# Altium schematic sheet ArduinoUnoCopy_Schematic.SchDoc
size C; SheetNumber: 1; SheetTotal: 1
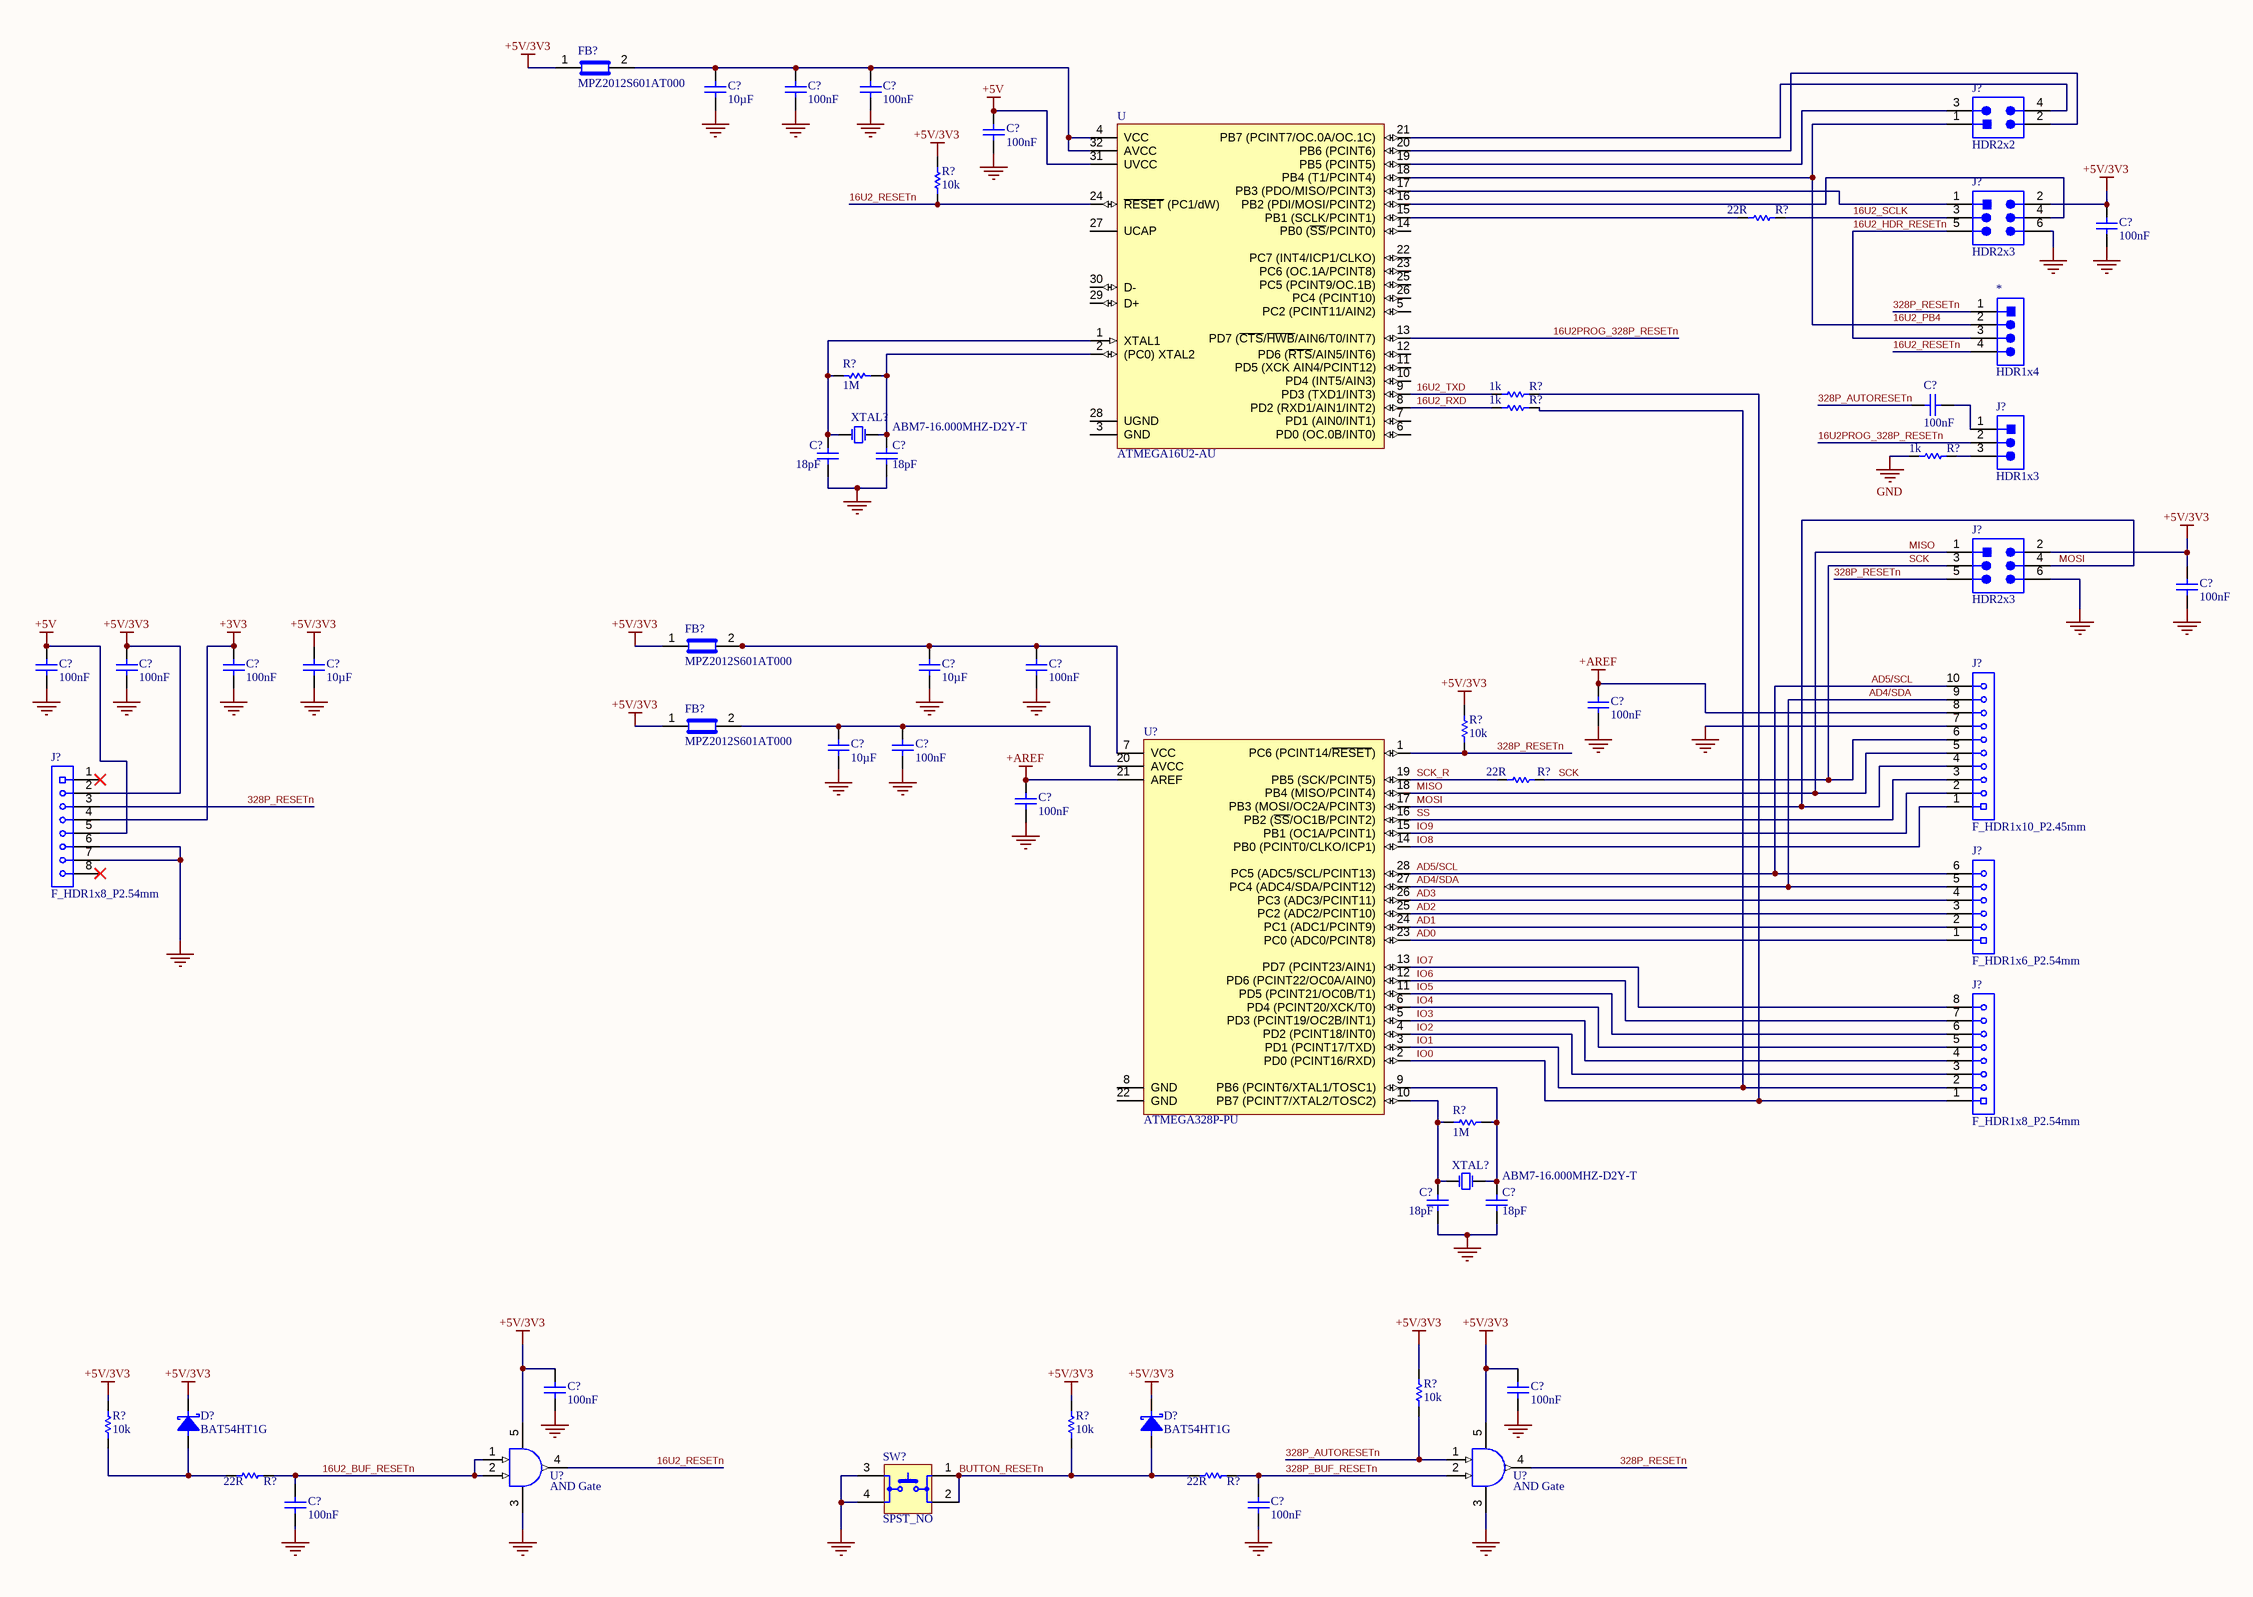
[diagram p0: ArduinoUnoCopy_Schematic.SchDoc]

## Parts
(Parts that share a designator on the sheet are numbered #1, #2 ... from top to bottom, then left to right.)
*  HDR1x4  [M_HDR1x4_P2.54mm]
C?#1  10µF  [C0805]
C?#2  100nF  [C0805]
C?#3  100nF  [C0805]
C?#4  100nF  [C0805]
C?#5  100nF  [C0805]
C?#6  100nF  [C0805]
C?#7  18pF  [C0805]
C?#8  18pF  [C0805]
C?#9  100nF  [C0805]
C?#10  100nF  [C0805]
C?#11  100nF  [C0805]
C?#12  100nF  [C0805]
C?#13  10µF  [C0805]
C?#14  10µF  [C0805]
C?#15  100nF  [C0805]
C?#16  100nF  [C0805]
C?#17  10µF  [C0805]
C?#18  100nF  [C0805]
C?#19  100nF  [C0805]
C?#20  18pF  [C0805]
C?#21  18pF  [C0805]
C?#22  100nF  [C0805]
C?#23  100nF  [C0805]
C?#24  100nF  [C0805]
C?#25  100nF  [C0805]
D?#1  BAT54HT1G  [SOD323]
D?#2  BAT54HT1G  [SOD323]
FB?#1  MPZ2012S601AT000  [FB0805]
FB?#2  MPZ2012S601AT000  [FB0805]
FB?#3  MPZ2012S601AT000  [FB0805]
J?#1  HDR2x2  [M_HDR2x2_P2.54mm]
J?#2  HDR2x3  [M_HDR2x3_P2.54mm]
J?#3  HDR1x3  [M_HDR1x3_P2.54mm]
J?#4  HDR2x3  [M_HDR2x3_P2.54mm]
J?#5  F_HDR1x8_P2.54mm  [F_HDR1x8_P2.54mm]
J?#6  F_HDR1x10_P2.45mm  [F_HDR1x10_P2.54mm]
J?#7  F_HDR1x6_P2.54mm  [F_HDR1x6_P2.54mm]
J?#8  F_HDR1x8_P2.54mm  [F_HDR1x8_P2.54mm]
R?#1  10k  [R0805]
R?#2  22R  [R0805]
R?#3  1M  [R0805]
R?#4  1k  [R0805]
R?#5  1k  [R0805]
R?#6  1k  [R0805]
R?#7  10k  [R0805]
R?#8  22R  [R0805]
R?#9  1M  [R0805]
R?#10  10k  [R0805]
R?#11  10k  [R0805]
R?#12  10k  [R0805]
R?#13  22R  [R0805]
R?#14  22R  [R0805]
SW?  SPST_NO  [SPST-NO_P4.5mmx7.8mm_H5mm]
U  ATMEGA16U2-AU  [TQFP32P080W7X7]
U?#1  ATMEGA328P-PU  [DIP28P254LS726mm]
U?#2  AND Gate  [SOT23_P0.95mm]
U?#3  AND Gate  [SOT23_P0.95mm]
XTAL?#1  ABM7-16.000MHZ-D2Y-T
XTAL?#2  ABM7-16.000MHZ-D2Y-T

## Nets
+3V3: C?#12.2 J?#5.4
+5V: C?#4.2 C?#10.2 J?#5.5 U.31(UVCC)
+5V/3V3: C?#5.2 C?#9.2 C?#11.2 C?#13.2 C?#22.2 C?#23.2 D?#1.C(Cathode) D?#2.C(Cathode) FB?#1.1 FB?#2.1 FB?#3.1 J?#2.2 J?#4.2 J?#5.2 R?#1.2 R?#7.2 R?#10.2 R?#11.2 R?#12.2 U?#2.5(VCC) U?#3.5(VCC)
+AREF: C?#16.2 C?#19.2 J?#6.8 U?#1.21(AREF)
GND: C?#1.1 C?#2.1 C?#3.1 C?#4.1 C?#5.1 C?#7.1 C?#8.1 C?#9.1 C?#10.1 C?#11.1 C?#12.1 C?#13.1 C?#14.1 C?#15.1 C?#16.1 C?#17.1 C?#18.1 C?#19.1 C?#20.1 C?#21.1 C?#22.1 C?#23.1 C?#24.1 C?#25.1 J?#2.6 J?#4.6 J?#5.6 J?#5.7 J?#6.7 R?#6.1 SW?.3 SW?.4 U?#2.3(GND) U?#3.3(GND)
16U2_BUF_RESETn: C?#24.2 R?#13.2 U?#2.1(A) U?#2.2(B)
16U2_HDR_RESETn: *.3 J?#2.5
16U2_PB4: *.2 J?#1.1 U.18(PB4_(T1/PCINT4))
16U2_RESETn: *.4 R?#1.1 U.24(~{RESET}_(PC1/dW)) U?#2.4(Y)
16U2_RXD: R?#5.1 U.8(PD2_(RXD1/AIN1/INT2))
16U2_SCLK: J?#2.3 R?#2.2
16U2_TXD: R?#4.1 U.9(PD3_(TXD1/INT3))
16U2PROG_328P_RESETn: J?#3.2 U.13(PD7_(~{CTS}/~{HWB}/AIN6/T0/INT7))
328P_AUTORESETn: C?#6.1 R?#10.1 U?#3.1(A)
328P_BUF_RESETn: C?#25.2 R?#14.2 U?#3.2(B)
328P_RESETn: *.1 J?#4.5 J?#5.3 R?#7.1 U?#1.1(PC6_(PCINT14/~{RESET})) U?#3.4(Y)
AD0: J?#7.1 U?#1.23(PC0_(ADC0/PCINT8))
AD1: J?#7.2 U?#1.24(PC1_(ADC1/PCINT9))
AD2: J?#7.3 U?#1.25(PC2_(ADC2/PCINT10))
AD3: J?#7.4 U?#1.26(PC3_(ADC3/PCINT11))
AD4/SDA: J?#6.9 J?#7.5 U?#1.27(PC4_(ADC4/SDA/PCINT12))
AD5/SCL: J?#6.10 J?#7.6 U?#1.28(PC5_(ADC5/SCL/PCINT13))
BUTTON_RESETn: D?#2.A(Anode) R?#12.1 R?#14.1 SW?.1 SW?.2
IO0: J?#8.1 R?#4.2 U?#1.2(PD0_(PCINT16/RXD))
IO1: J?#8.2 R?#5.2 U?#1.3(PD1_(PCINT17/TXD))
IO2: J?#8.3 U?#1.4(PD2_(PCINT18/INT0))
IO3: J?#8.4 U?#1.5(PD3_(PCINT19/OC2B/INT1))
IO4: J?#8.5 U?#1.6(PD4_(PCINT20/XCK/T0))
IO5: J?#8.6 U?#1.11(PD5_(PCINT21/OC0B/T1))
IO6: J?#8.7 U?#1.12(PD6_(PCINT22/OC0A/AIN0))
IO7: J?#8.8 U?#1.13(PD7_(PCINT23/AIN1))
IO8: J?#6.1 U?#1.14(PB0_(PCINT0/CLKO/ICP1))
IO9: J?#6.2 U?#1.15(PB1_(OC1A/PCINT1))
MISO: J?#4.1 J?#6.5 U?#1.18(PB4_(MISO/PCINT4))
MOSI: J?#4.4 J?#6.4 U?#1.17(PB3_(MOSI/OC2A/PCINT3))
SCK: J?#4.3 J?#6.6 R?#8.2
SCK_R: R?#8.1 U?#1.19(PB5_(SCK/PCINT5))
SS: J?#6.3 U?#1.16(PB2_(~{SS}/OC1B/PCINT2))
NetC?#1_2: C?#1.2 C?#2.2 C?#3.2 FB?#1.2 U.4(VCC) U.32(AVCC)
NetC?#6_2: C?#6.2 J?#3.1
NetC?#7_2: C?#7.2 R?#3.2 U.1(XTAL1) XTAL?#1.2(X2)
NetC?#8_2: C?#8.2 R?#3.1 U.2((PC0)_XTAL2) XTAL?#1.1(X1)
NetC?#14_2: C?#14.2 C?#15.2 FB?#2.2 U?#1.7(VCC)
NetC?#17_2: C?#17.2 C?#18.2 FB?#3.2 U?#1.20(AVCC)
NetC?#20_2: C?#20.2 R?#9.1 U?#1.10(PB7_(PCINT7/XTAL2/TOSC2)) XTAL?#2.1(X1)
NetC?#21_2: C?#21.2 R?#9.2 U?#1.9(PB6_(PCINT6/XTAL1/TOSC1)) XTAL?#2.2(X2)
NetD?#1_A: D?#1.A(Anode) R?#11.1 R?#13.1
NetJ?#1_2: J?#1.2 U.20(PB6_(PCINT6))
NetJ?#1_3: J?#1.3 U.19(PB5_(PCINT5))
NetJ?#1_4: J?#1.4 U.21(PB7_(PCINT7/OC.0A/OC.1C))
NetJ?#2_1: J?#2.1 U.17(PB3_(PDO/MISO/PCINT3))
NetJ?#2_4: J?#2.4 U.16(PB2_(PDI/MOSI/PCINT2))
NetJ?#3_3: J?#3.3 R?#6.2
NetR?#2_1: R?#2.1 U.15(PB1_(SCLK/PCINT1))

Not connected (* = marked no-connect by the designer): J?#5 1* 8*; U 3(GND) 5(PC2_(PCINT11/AIN2)) 6(PD0_(OC.0B/INT0)) 7(PD1_(AIN0/INT1)) 10(PD4_(INT5/AIN3)) 11(PD5_(XCK_AIN4/PCINT12)) 12(PD6_(~{RTS}/AIN5/INT6)) 14(PB0_(~{SS}/PCINT0)) 22(PC7_(INT4/ICP1/CLKO)) 23(PC6_(OC.1A/PCINT8)) 25(PC5_(PCINT9/OC.1B)) 26(PC4_(PCINT10)) 27(UCAP) 28(UGND) 29(D+) 30(D-); U?#1 8(GND) 22(GND)

## Notes on the sheet
- THIS DOCUMENT AND THE DATA DISCLOSED HEREIN OR
- HEREWITH IS THE PROPERTY OF ALTIUM LIMITED AND MAY
- DWG NO:
- REVISION
- REV:
- DESCRIPTION
- DATE
- APPROVED
- BE FREELY DISTRIBUTED IN WHOLE. NO RIGHTS ARE
- RESERVED OR EXPRESS OR IMPLIED WARANTEE GIVEN.
- ENG:
- APPROVALS
- PROJECT
- DSN:
- CHK:
- REFERENCE DOCUMENTS
- PROJECT REVISION:
- TITLE
- DOCUMENT REVISION:
- DESIGN ITEM:
- BOM:
- FAB DWG:
- PCB DWG:
- ASSY DWG:
- SCALE:
- A3
- SIZE
- CAGE CODE
- FILE NAME
- DWG NO.
- SHEET
- OF
- REV

## Library data of the parts
* = 68001-204HLF: CONN HEADER VERT 4POS 2.54MM; Manufacturer: Amphenol FCI; Number of Contacts: 4; Insulation Resistance: 5GR; Gender: Male; Current Rating: 3A; Voltage Rating: 1.5kV; Connector Type: Male Pin; Contact Post Length: 3.05mm; Part Name: 68001-204HLF; Supplier 1: Farnell; Supplier Part Number 1: 2892426; Manufacturer Part Number: 68001-204HLF; RoHS: Yes; Category: Headers and Wire Housings; Stock 1: 1286; Pricing 1: 1=0,36400, 10=0,25600, 25=0,25200, 50=0,25000; Mount: Through Hole; Contact Plating: Gold,GXT; Contact Material: Bronze; Color: Black; Housing Material: Thermoplastic; Min Operating Temperature: -65°C; Max Operating Temperature: 125°C; Termination: Solder; Number of Rows: 1; Orientation: Straight; Number of Positions: 4; Packaging: Bulk; Package Quantity: 100; Contact Gender: Male; Pitch: 2.54mm; Contact Mating Length: 0.23inch; Radiation Hardening: No; Flammability Rating: UL94 V-0; ComponentLink1URL: https://datasheet.ciiva.com/5164/68000-274255; ComponentLink1Description: https://datasheet.ciiva.com/5164/68000-274255; ComponentLink2URL: https://datasheet.ciiva.com/726/68000-726529.; ComponentLink2Description: https://datasheet.ciiva.com/726/68000-726529.
C?#1 C?#13 C?#14 C?#17 = C2012X5R1E106K125AB: TDK - C2012X5R1E106K125AB - Keramikvielschich; Dielectric Material: Ceramic; Capacitance: 10uF; Tolerance: 10%; Dielectric: X5R; Voltage Rating: 25V; Part Name: C2012X5R1E106K125AB; Supplier 1: Farnell; Supplier Part Number 1: 2346927; Manufacturer: TDK; Manufacturer Part Number: C2012X5R1E106K125AB; RoHS: Yes; Category: Ceramic Capacitors; Stock 1: 21227; Pricing 1: 5=0,25900, 50=0,14600, 250=0,14100, 500=0,106; Mount: Surface Mount; Case/Package: 0805; Case Code (Metric): 2012; Case Code (Imperial): 0805; Weight: 0.000194oz; Min Operating Temperature: -55°C; Max Operating Temperature: 85°C; Packaging: Tape and Reel; Voltage Rating (DC): 25V; Termination: SMD/SMT; Package Quantity: 1; Resistor Type: Ceramic; Voltage: 25V; Length: 2mm; Width: 0.049inch; Height: 1.25mm; Depth: 1.25mm; Thickness: 0.057inch; REACH SVHC: No SVHC; Lead Free: Lead Free; ComponentLink1URL: https://datasheet.ciiva.com/22725/1913358-227; ComponentLink1Description: https://datasheet.ciiva.com/22725/1913358-227; ComponentLink2URL: https://datasheet.ciiva.com/16394/general-b11; ComponentLink2Description: https://datasheet.ciiva.com/16394/general-b11; ComponentLink3URL: https://datasheet.ciiva.com/24216/mlcc-commer; ComponentLink3Description: https://datasheet.ciiva.com/24216/mlcc-commer
C?#2-C?#6 C?#9-C?#12 C?#15 C?#16 C?#18 C?#19 C?#22-C?#25 = C2012X7R1H104K085AA: TDK - C2012X7R1H104K085AA - SMD Multilayer Ce; Dielectric Material: Ceramic; Tolerance: 10%; Dielectric: X7R; Voltage Rating: 50V; Part Name: C2012X7R1H104K085AA; Supplier 1: Farnell; Supplier Part Number 1: 2525147; Manufacturer: TDK; Manufacturer Part Number: C2012X7R1H104K085AA; RoHS: Yes; Category: Ceramic Capacitors; Stock 1: 12319; Pricing 1: 10=0,06990, 100=0,05700, 500=0,03580, 1000=0,; Mount: Surface Mount; Case/Package: 0805; Number of Pins: 2; Case Code (Metric): 2012; Case Code (Imperial): 0805; Weight: 0.000194oz; Min Operating Temperature: -55°C; Max Operating Temperature: 125°C; Capacitance: 100nF; Packaging: Tape and Reel; Voltage Rating (DC): 50V; Termination: SMD/SMT; Package Quantity: 1; Resistor Type: Ceramic; Voltage: 50V; Length: 2mm; Width: 0.049inch; Height: 0.85mm; Depth: 1.25mm; Thickness: 0.037inch; Radiation Hardening: No; REACH SVHC: No SVHC; Lead Free: Lead Free; ComponentLink1URL: https://datasheet.ciiva.com/11788/0900766b80c; ComponentLink1Description: https://datasheet.ciiva.com/11788/0900766b80c; ComponentLink2URL: https://datasheet.ciiva.com/6250/tdkmlcccapra; ComponentLink2Description: https://datasheet.ciiva.com/6250/tdkmlcccapra; ComponentLink3URL: https://datasheet.ciiva.com/24191/e412-c-2419; ComponentLink3Description: https://datasheet.ciiva.com/24191/e412-c-2419; ComponentLink4URL: https://datasheet.ciiva.com/6250/tdkmlcccapra; ComponentLink4Description: https://datasheet.ciiva.com/6250/tdkmlcccapra; ComponentLink5URL: https://datasheet.ciiva.com/23803/1796654-238; ComponentLink5Description: https://datasheet.ciiva.com/23803/1796654-238; ComponentLink6URL: https://datasheet.ciiva.com/28602/1571323-286; ComponentLink6Description: https://datasheet.ciiva.com/28602/1571323-286
C?#7 C?#8 C?#20 C?#21 = C0805C180J5GACTU: CAP CER 18PF 50V C0G/NP0 0805; Manufacturer: KEMET; Dielectric Material: Ceramic; Tolerance: 5%; Dielectric: C0G; Temperature Coefficient: 30ppm/°C; Part Name: C0805C180J5GACTU; Supplier 1: Farnell; Supplier Part Number 1: 1414673; Manufacturer Part Number: C0805C180J5GACTU; RoHS: Yes; Category: Ceramic Capacitors; Stock 1: 37559; Pricing 1: 10=0,04930, 100=0,03400, 500=0,02640, 1000=0,; Mount: Surface Mount; Case/Package: 0805; Min Operating Temperature: -55°C; Max Operating Temperature: 125°C; Capacitance: 18pF; Packaging: Tape and Reel; Voltage Rating (DC): 50V; Termination: SMD/SMT; Voltage: 50V; Length: 2mm; Height: 0.78mm; Depth: 1.25mm; Radiation Hardening: No; Lead Free: Lead Free; ComponentLink1URL: https://datasheet.ciiva.com/22746/1769375-227; ComponentLink1Description: https://datasheet.ciiva.com/22746/1769375-227; ComponentLink2URL: https://datasheet.ciiva.com/26923/getdatashee; ComponentLink2Description: https://datasheet.ciiva.com/26923/getdatashee; ComponentLink3URL: https://datasheet.ciiva.com/26847/getdatashee; ComponentLink3Description: https://datasheet.ciiva.com/26847/getdatashee; Contact Plating: Tin,Matte
D?#1 D?#2 = BAT54HT1G: Small Signal Schottky Diode, Single, 30 V, 200 mA, 800 mV, 600 mA, 150 C ;RoHS Compliant: Yes; Manufacturer: ON Semiconductor / Fairchild; Forward Voltage: 800mV; Forward Current: 200mA; Recovery Time: 5ns; Max Repetitive Reverse Voltage (Vrrm): 30V; Peak Non-Repetitive Surge Current: 600mA; Max Reverse Current: 2uA; Power Dissipation: 200mW; Polarity: Standard; Capacitance: 10pF; Part Name: BAT54HT1G; Supplier 1: Farnell; Supplier Part Number 1: 1459033; Manufacturer Part Number: BAT54HT1G; RoHS: Yes; Category: Schottky Diodes; Stock 1: 20128; Pricing 1: 5=0,18300, 10=0,15600, 100=0,05220, 500=0,05120 (GBP); Mount: Surface Mount; Number of Pins: 2; Contact Plating: Tin,Matte; Min Operating Temperature: -55°C; Max Operating Temperature: 150°C; Packaging: Tape and Reel; Package Quantity: 3000; Average Rectified Current: 200mA; Reverse Recovery Time: 5ns; Max Forward Surge Current (Ifsm): 600mA; Element Configuration: Single; Max Reverse Voltage (DC): 30V; Max Surge Current: 600mA; Voltage Rating (DC): 30V; Current Rating: 200mA; Output Current: 200mA; Reverse Voltage: 30V; Max Reverse Leakage Current: 2uA; Length: 1.8mm; Width: 1.35mm; Height: 1mm; Radiation Hardening: No; Lead Free: Lead Free; RoHS Compliant: Yes; REACH SVHC: No SVHC; ComponentLink1URL: https://datasheet.ciiva.com/4714/bat54ht1-d-72881-4714706.pdf?src-supplier=Mouser; ComponentLink1Description: https://datasheet.ciiva.com/4714/bat54ht1-d-72881-4714706.pdf?src-supplier=Mouser; ComponentLink2URL: https://datasheet.ciiva.com/30479/0900766b811a63a9-30479442.pdf?src-supplier=RSComponents; ComponentLink2Description: https://datasheet.ciiva.com/30479/0900766b811a63a9-30479442.pdf?src-supplier=RSComponents; ComponentLink3URL: https://datasheet.ciiva.com/34301/806549-34301562.pdf?src-supplier=Jameco; ComponentLink3Description: https://datasheet.ciiva.com/34301/806549-34301562.pdf?src-supplier=Jameco; ComponentLink4URL: https://datasheet.ciiva.com/1240/1747983-1240762.pdf?src-supplier=Newark; ComponentLink4Description: https://datasheet.ciiva.com/1240/1747983-1240762.pdf?src-supplier=Newark; ComponentLink5URL: https://datasheet.ciiva.com/4452/bat54ht1g-104602-4452889.pdf?src-supplier=Mouser; ComponentLink5Description: https://datasheet.ciiva.com/4452/bat54ht1g-104602-4452889.pdf?src-supplier=Mouser; ComponentLink6URL: https://datasheet.ciiva.com/910/bat54ht1g-910497.pdf?src-supplier=Digi-Key; ComponentLink6Description: https://datasheet.ciiva.com/910/bat54ht1g-910497.pdf?src-supplier=Digi-Key; ComponentLink7URL: https://datasheet.ciiva.com/1180/bat54ht1-d-1180252.pdf?src-supplier=Element14; ComponentLink7Description: https://datasheet.ciiva.com/1180/bat54ht1-d-1180252.pdf?src-supplier=Element14; ComponentLink8URL: https://datasheet.ciiva.com/1180/bat54ht1-d-1180251.pdf?src-supplier=Element14; ComponentLink8Description: https://datasheet.ciiva.com/1180/bat54ht1-d-1180251.pdf?src-supplier=Element14; ComponentLink9URL: https://datasheet.ciiva.com/46429/1727620-46429206.pdf?src-supplier=Element14; ComponentLink9Description: https://datasheet.ciiva.com/46429/1727620-46429206.pdf?src-supplier=Element14; ComponentLink10URL: https://datasheet.ciiva.com/8294/bat54ht1-d-8294645.pdf?src-supplier=Avnet
FB?#1-FB?#3 = MPZ2012S601AT000: FERRITE BEAD 600 OHM 0805 1LN; Manufacturer: TDK; Impedance: 600R; Current Rating: 2A; DC Resistance (DCR): 100mR; Part Name: MPZ2012S601AT000; Supplier 1: Farnell; Supplier Part Number 1: 2393201; Manufacturer Part Number: MPZ2012S601AT000; RoHS: Yes; Category: Ferrite Beads and Chips; Stock 1: 13705; Pricing 1: 1=0,11600, 25=0,08910, 50=0,06600, 100=0,0410; Mount: Surface Mount; Case/Package: 0805; Case Code (Metric): 2012; Case Code (Imperial): 0805; Packaging: Tape and Reel; Package Quantity: 1; Max DC Current: 2A; Length: 0.079inch; Width: 0.049inch; Height: 0.041inch; REACH SVHC: No SVHC; Lead Free: Lead Free; ComponentLink1URL: https://datasheet.ciiva.com/46634/beads-comme; ComponentLink1Description: https://datasheet.ciiva.com/46634/beads-comme; ComponentLink2URL: https://datasheet.ciiva.com/46634/beads-comme; ComponentLink2Description: https://datasheet.ciiva.com/46634/beads-comme; ComponentLink3URL: https://datasheet.ciiva.com/46634/beads-comme; ComponentLink3Description: https://datasheet.ciiva.com/46634/beads-comme
J?#1 = 67997-104HLF: CONN HEADER VERT 4POS 2.54MM; Manufacturer: Amphenol FCI; Number of Contacts: 4; Insulation Resistance: 5GR; Max Voltage Rating (AC): 1.5kV; Gender: Male; Current Rating: 3A; Connector Type: Male Pin; Row Spacing: 0.1inch; Contact Post Length: 3.05mm; Part Name: 67997-104HLF; Supplier 1: Farnell; Supplier Part Number 1: 1835263; Manufacturer Part Number: 67997-104HLF; RoHS: Yes; Category: Headers and Wire Housings; Stock 1: 431; Pricing 1: 1=0,29600, 10=0,21200, 25=0,20800, 50=0,20500; Mount: Through Hole; Contact Plating: Gold,GXT; Housing Color: Black; Contact Material: Bronze; Color: Black; Housing Material: Thermoplastic; Min Operating Temperature: -65°C; Max Operating Temperature: 125°C; Termination: Solder; Number of Rows: 2; Orientation: Straight; Number of Positions: 4; Packaging: Bulk; Package Quantity: 100; Contact Gender: Male; Voltage Rating: 1.5kV; Length: 5.08mm; Pitch: 2.54mm; Contact Mating Length: 0.23inch; Depth: 4.83mm; Radiation Hardening: No; REACH SVHC: No SVHC; Flammability Rating: UL94 V-0; ComponentLink1URL: https://datasheet.ciiva.com/5156/67996-223376; ComponentLink1Description: https://datasheet.ciiva.com/5156/67996-223376; ComponentLink2URL: https://datasheet.ciiva.com/728/67996-728900.; ComponentLink2Description: https://datasheet.ciiva.com/728/67996-728900.; ComponentLink3URL: https://datasheet.ciiva.com/10149/67996-10149; ComponentLink3Description: https://datasheet.ciiva.com/10149/67996-10149; ComponentLink4URL: https://datasheet.ciiva.com/46395/1876884-463; ComponentLink4Description: https://datasheet.ciiva.com/46395/1876884-463; ComponentLink5URL: https://datasheet.ciiva.com/16726/67996-16726; ComponentLink5Description: https://datasheet.ciiva.com/16726/67996-16726
J?#2 J?#4 = 67997-106HLF: CONN HEADER 6POS .100 STR 30AU; Manufacturer: Amphenol FCI; Number of Contacts: 6; Insulation Resistance: 5GR; Max Voltage Rating (AC): 1.5kV; Gender: Male; Current Rating: 3A; Connector Type: Male Pin; Pitch: 2.54mm; Row Spacing: 0.1inch; Contact Post Length: 3.05mm; Part Name: 67997-106HLF; Supplier 1: Farnell; Supplier Part Number 1: 1835250; Manufacturer Part Number: 67997-106HLF; RoHS: Yes; Category: Headers and Wire Housings; Stock 1: 34; Pricing 1: 1=1,73000, 10=1,43000, 25=1,42000, 50=1,40000; Mount: Through Hole; Contact Plating: Gold,GXT; Housing Color: Black; Contact Material: Bronze; Color: Black; Housing Material: Thermoplastic; Min Operating Temperature: -65°C; Max Operating Temperature: 125°C; Termination: Through Hole; Number of Rows: 2; Orientation: Straight; Number of Positions: 6; Packaging: Bulk; Package Quantity: 100; Contact Gender: Male; Voltage Rating: 1.5kV; Length: 7.62mm; Contact Mating Length: 0.23inch; Depth: 4.83mm; Radiation Hardening: No; Lead Free: Lead Free; REACH SVHC: No SVHC; Flammability Rating: UL94 V-0; ComponentLink1URL: https://datasheet.ciiva.com/5153/67996-222463; ComponentLink1Description: https://datasheet.ciiva.com/5153/67996-222463; ComponentLink2URL: https://datasheet.ciiva.com/16726/67996-16726; ComponentLink2Description: https://datasheet.ciiva.com/16726/67996-16726; ComponentLink3URL: https://datasheet.ciiva.com/722/67996-722044.; ComponentLink3Description: https://datasheet.ciiva.com/722/67996-722044.; ComponentLink4URL: https://datasheet.ciiva.com/10149/67996-10149; ComponentLink4Description: https://datasheet.ciiva.com/10149/67996-10149; ComponentLink5URL: https://datasheet.ciiva.com/46393/1876884-463; ComponentLink5Description: https://datasheet.ciiva.com/46393/1876884-463
J?#3 = 68000-103HLF: Conn Unshrouded Header HDR 3 POS 2.54mm Solde; Manufacturer: Amphenol FCI; Number of Contacts: 3; Insulation Resistance: 5GR; Max Voltage Rating (AC): 1.5kV; Gender: Male; Current Rating: 3A; Connector Type: Male Pin; Contact Post Length: 2.41mm; Part Name: 68000-103HLF; Supplier 1: Farnell; Supplier Part Number 1: 2668453; Manufacturer Part Number: 68000-103HLF; RoHS: Yes; Category: Headers and Wire Housings; Stock 1: 3541; Pricing 1: 10=0,18200, 100=0,13100, 500=0,12000, 1000=0,; Mount: Through Hole; Contact Plating: Gold,GXT; Housing Color: Black; Contact Material: Bronze; Color: Black; Housing Material: Thermoplastic; Min Operating Temperature: -65°C; Max Operating Temperature: 125°C; Termination: Through Hole; Number of Rows: 1; Orientation: Straight; Number of Positions: 3; Packaging: Bulk; Package Quantity: 100; Contact Gender: Male; Voltage Rating: 1.5kV; Length: 7.62mm; Pitch: 2.54mm; Contact Mating Length: 5.84mm; Depth: 2.41mm; Radiation Hardening: No; REACH SVHC: No SVHC; Flammability Rating: UL94 V-0; ComponentLink1URL: https://datasheet.ciiva.com/5157/68000-274283; ComponentLink1Description: https://datasheet.ciiva.com/5157/68000-274283; ComponentLink2URL: https://datasheet.ciiva.com/10149/68000-10149; ComponentLink2Description: https://datasheet.ciiva.com/10149/68000-10149; ComponentLink3URL: https://datasheet.ciiva.com/46392/1914865-463; ComponentLink3Description: https://datasheet.ciiva.com/46392/1914865-463
J?#5 J?#8 = M20-7820842: 2.54mm (0.1") Pitch SIL Vertical PC Tail Sock; Manufacturer: Harwin; Number of Contacts: 8; Connector Type: Receptacle,Socket; Gender: Female; Max Current Rating: 3A; Contact Resistance: 20mR; Part Name: M20-7820842; Supplier 1: Farnell; Supplier Part Number 1: 3225927; Manufacturer Part Number: M20-7820842; RoHS: Yes; Category: Headers and Wire Housings; Stock 1: 50; Pricing 1: 10=0,75600, 50=0,70400, 100=0,65200, 250=0,59; Mount: Through Hole; Case/Package: SIL; Housing Color: Black; Color: Black; Contact Plating: Tin,Gold; Contact Material: Bronze; Housing Material: Polyamide; Min Operating Temperature: -40°C; Max Operating Temperature: 105°C; Termination: Solder; Number of Rows: 1; Orientation: Straight; Number of Positions: 8; Packaging: Rail/Tube; Contact Gender: Female; Package Quantity: 29; Length: 20.72mm; Pitch: 2.54mm; Depth: 2.5mm; Radiation Hardening: No; ComponentLink1URL: https://datasheet.ciiva.com/16732/m20-782-167; ComponentLink1Description: https://datasheet.ciiva.com/16732/m20-782-167; ComponentLink2URL: https://datasheet.ciiva.com/9480/m20-782-9480; ComponentLink2Description: https://datasheet.ciiva.com/9480/m20-782-9480; Weight: 0.025397oz
J?#6 = M20-7821046: HARWIN - M20-7821046 - Board-To-Board Connect; Number of Contacts: 10; Connector Type: Receptacle,Socket; Gender: Receptacle; Insulation Resistance: 1MR; Max Current Rating: 3A; Contact Resistance: 20mR; Mating Cycles: 50; Pitch: 2.54mm; Hole Diameter: 0.8mm; Part Name: M20-7821046; Supplier 1: Farnell; Supplier Part Number 1: 7991959; Manufacturer: Harwin; Manufacturer Part Number: M20-7821046; RoHS: Yes; Category: Headers and Wire Housings; Stock 1: 1442; Pricing 1: 1=1,03000, 10=0,89900, 100=0,77600, 500=0,634; Mount: Through Hole; Case/Package: SIL; Housing Color: Black; Color: Black; Contact Plating: Tin; Contact Material: Bronze; Housing Material: Polyamide; Min Operating Temperature: -40°C; Max Operating Temperature: 105°C; Termination: Solder; Number of Rows: 1; Orientation: Straight; Number of Positions: 10; Packaging: Rail/Tube; Contact Gender: Female; Package Quantity: 23; Current Rating: 3A; Length: 25.8mm; Depth: 2.5mm; Lead Pitch: 2.54mm; Radiation Hardening: No; REACH SVHC: No SVHC; ComponentLink1URL: https://datasheet.ciiva.com/26899/getdatashee; ComponentLink1Description: https://datasheet.ciiva.com/26899/getdatashee; ComponentLink2URL: https://datasheet.ciiva.com/11753/0900766b80d; ComponentLink2Description: https://datasheet.ciiva.com/11753/0900766b80d; ComponentLink3URL: https://datasheet.ciiva.com/6785/m20-782-6785; ComponentLink3Description: https://datasheet.ciiva.com/6785/m20-782-6785; ComponentLink4URL: https://datasheet.ciiva.com/10151/m20-782-101; ComponentLink4Description: https://datasheet.ciiva.com/10151/m20-782-101; ComponentLink5URL: https://datasheet.ciiva.com/16732/m20-782-167; ComponentLink5Description: https://datasheet.ciiva.com/16732/m20-782-167
J?#7 = M20-7820646: 06-WAY SIL VERT SOCKET L/FREE; Manufacturer: Harwin; Number of Contacts: 6; Connector Type: Receptacle,Socket; Gender: Female; Max Current Rating: 3A; Contact Resistance: 20mR; Pitch: 2.54mm; Part Name: M20-7820646; Supplier 1: Farnell; Supplier Part Number 1: 3225925; Manufacturer Part Number: M20-7820646; RoHS: Yes; Category: Headers and Wire Housings; Stock 1: 731; Pricing 1: 10=0,65500, 50=0,61000, 100=0,56500, 250=0,51; Mount: Through Hole; Case/Package: SIL; Housing Color: Black; Color: Black; Contact Plating: Tin; Contact Material: Bronze; Housing Material: Nylon; Min Operating Temperature: -40°C; Max Operating Temperature: 105°C; Termination: Solder; Number of Rows: 1; Orientation: Straight; Number of Positions: 6; Packaging: Rail/Tube; Contact Gender: Female; Package Quantity: 38; Length: 15.64mm; Depth: 2.5mm; Radiation Hardening: No; ComponentLink1URL: http://components.arrow.com/part/dataview/032; ComponentLink1Description: http://components.arrow.com/part/dataview/032; ComponentLink2URL: http://www.harwin.com/include/downloads/pdfs/; ComponentLink2Description: http://www.harwin.com/include/downloads/pdfs/; ComponentLink3URL: https://cdn.harwin.com/pdfs/M20-782.pdf?src-s; ComponentLink3Description: https://cdn.harwin.com/pdfs/M20-782.pdf?src-s; ComponentLink4URL: https://cdn.harwin.com/pdfs/Harwin_PC_Connect; ComponentLink4Description: https://cdn.harwin.com/pdfs/Harwin_PC_Connect; ComponentLink5URL: https://cdn.harwin.com/pdfs/Harwin_PC_Connect; ComponentLink5Description: https://cdn.harwin.com/pdfs/Harwin_PC_Connect; ComponentLink6URL: https://cdn.harwin.com/pdfs/Harwin_PC_Connect; ComponentLink6Description: https://cdn.harwin.com/pdfs/Harwin_PC_Connect; ComponentLink7URL: https://cdn.harwin.com/pdfs/Harwin_PC_Connect; ComponentLink7Description: https://cdn.harwin.com/pdfs/Harwin_PC_Connect
R?#1 R?#7 R?#10-R?#12 = RC0805FR-0710KL: RES SMD 10K OHM 1% 1/8W 0805; Manufacturer: Yageo; Resistance: 10kR; Power Rating: 125mW; Temperature Coefficient: 100ppm/°C; Voltage Rating: 150V; Part Name: RC0805FR-0710KL; Supplier Part Number 1: 9237755; Manufacturer Part Number: RC0805FR-0710KL; RoHS: Yes; Category: Chip SMD Resistors; Stock 1: 10456; Pricing 1: 10=0,03070, 100=0,01060, 500=0,00900, 1000=0,; Case/Package: 0805; Case Code (Imperial): 0805; Case Code (Metric): 2012; Min Operating Temperature: -55°C; Max Operating Temperature: 155°C; Tolerance: 1%; Packaging: Tape and Reel; Resistor Type: Thick Film; Termination: SMD/SMT; Number of Terminations: 2; Max Power Dissipation: 125mW; Package Quantity: 1; Features: Moisture Resistant; Length: 2mm; Width: 0.049inch; Height: 0.024inch; Depth: 1.25mm; Lead Free: Lead Free; Military Standard: Not; REACH SVHC: Unknown; ComponentLink1URL: https://datasheet.ciiva.com/11808/0900766b810; ComponentLink1Description: https://datasheet.ciiva.com/11808/0900766b810; ComponentLink2URL: https://datasheet.ciiva.com/12669/rc0805-1266; ComponentLink2Description: https://datasheet.ciiva.com/12669/rc0805-1266; ComponentLink3URL: https://datasheet.ciiva.com/46447/444164-4644; ComponentLink3Description: https://datasheet.ciiva.com/46447/444164-4644; ComponentLink4URL: https://datasheet.ciiva.com/2456/pyu-r-int-th; ComponentLink4Description: https://datasheet.ciiva.com/2456/pyu-r-int-th; ComponentLink5URL: https://datasheet.ciiva.com/2456/pyu-r-int-th; ComponentLink5Description: https://datasheet.ciiva.com/2456/pyu-r-int-th; ComponentLink6URL: https://datasheet.ciiva.com/2456/pyu-r-int-th; ComponentLink6Description: https://datasheet.ciiva.com/2456/pyu-r-int-th; Supplier 1: Farnell
R?#2 R?#8 R?#13 R?#14 = MCWR08X22R0FTL: MULTICOMP - MCWR08X22R0FTL - RES, 22R, 1%, 0.; Power Rating: 125mW; Temperature Coefficient: 100ppm/°C; Voltage Rating: 150V; Part Name: MCWR08X22R0FTL; Supplier Part Number 1: 2447609; Manufacturer: Multicomp; Manufacturer Part Number: MCWR08X22R0FTL; RoHS: Yes; Category: Uncategorized; Stock 1: 42387; Pricing 1: 10=0,00690, 100=0,00590, 500=0,00490, 1000=0,; Case/Package: 0805; Case Code (Imperial): 0805; Case Code (Metric): 2012; Resistance: 22R; Tolerance: 1%; Packaging: Cut Tape; Resistor Type: Thick Film; REACH SVHC: No SVHC; ComponentLink1URL: https://datasheet.ciiva.com/46398/1849611-463; ComponentLink1Description: https://datasheet.ciiva.com/46398/1849611-463; ComponentLink2URL: https://datasheet.ciiva.com/46398/1849611-463; ComponentLink2Description: https://datasheet.ciiva.com/46398/1849611-463; Supplier 1: Farnell; Mount: Surface Mount; Voltage Rating (DC): 150V
R?#3 R?#9 = RC0805JR-071ML: Res Thick Film 0805 1M Ohm 5% 1/8W 100ppm/C M; Manufacturer: Yageo; Resistance: 1MR; Power Rating: 125mW; Temperature Coefficient: 100ppm/°C; Voltage Rating: 150V; Part Name: RC0805JR-071ML; Supplier Part Number 1: 9234373; Manufacturer Part Number: RC0805JR-071ML; RoHS: Yes; Category: Chip SMD Resistors; Stock 1: 1480; Pricing 1: 10=0,02680, 100=0,00950, 500=0,00930, 1000=0,; Case/Package: 0805; Case Code (Imperial): 0805; Case Code (Metric): 2012; Contact Plating: Tin,Lead,Matte; Min Operating Temperature: -55°C; Max Operating Temperature: 155°C; Tolerance: 5%; Packaging: Tape and Reel; Resistor Type: Thick Film; Termination: SMD/SMT; Number of Terminations: 2; Max Power Dissipation: 125mW; Package Quantity: 1; Features: Moisture Resistant; Length: 0.079inch; Width: 0.049inch; Height: 0.024inch; Depth: 1.25mm; Radiation Hardening: No; Lead Free: Lead Free; Military Standard: Not; REACH SVHC: Unknown; ComponentLink1URL: https://datasheet.ciiva.com/2519/pyu-r-int-th; ComponentLink1Description: https://datasheet.ciiva.com/2519/pyu-r-int-th; ComponentLink2URL: https://datasheet.ciiva.com/2519/pyu-r-int-th; ComponentLink2Description: https://datasheet.ciiva.com/2519/pyu-r-int-th; ComponentLink3URL: https://datasheet.ciiva.com/16796/rc0805-1679; ComponentLink3Description: https://datasheet.ciiva.com/16796/rc0805-1679; ComponentLink4URL: https://datasheet.ciiva.com/7941/442941-79419; ComponentLink4Description: https://datasheet.ciiva.com/7941/442941-79419; ComponentLink5URL: https://datasheet.ciiva.com/7941/442941-79419; ComponentLink5Description: https://datasheet.ciiva.com/7941/442941-79419; ComponentLink6URL: https://datasheet.ciiva.com/46395/444164-4639; ComponentLink6Description: https://datasheet.ciiva.com/46395/444164-4639
R?#4-R?#6 = RC0805FR-071KL: RESISTOR, 0805 1K 1%, FULL REEL; Product Rang; Manufacturer: Yageo; Resistance: 1kR; Power Rating: 125mW; Temperature Coefficient: 100ppm/°C; Voltage Rating: 150V; Part Name: RC0805FR-071KL; Supplier Part Number 1: 9237496; Manufacturer Part Number: RC0805FR-071KL; RoHS: Yes; Category: Chip SMD Resistors; Stock 1: 120511; Pricing 1: 10=0,03070, 100=0,01060, 500=0,00900, 1000=0,; Case/Package: 0805; Case Code (Imperial): 0805; Case Code (Metric): 2012; Min Operating Temperature: -55°C; Max Operating Temperature: 155°C; Tolerance: 1%; Packaging: Tape and Reel; Resistor Type: Thick Film; Termination: SMD/SMT; Number of Terminations: 2; Max Power Dissipation: 125mW; Package Quantity: 1; Features: Moisture Resistant; Length: 0.079inch; Width: 0.049inch; Height: 0.024inch; Depth: 1.25mm; Lead Free: Lead Free; Military Standard: Not; REACH SVHC: Unknown; ComponentLink1URL: https://datasheet.ciiva.com/2456/pyu-r-int-th; ComponentLink1Description: https://datasheet.ciiva.com/2456/pyu-r-int-th; ComponentLink2URL: https://datasheet.ciiva.com/2456/pyu-r-int-th; ComponentLink2Description: https://datasheet.ciiva.com/2456/pyu-r-int-th; ComponentLink3URL: https://datasheet.ciiva.com/7941/1686128-7941; ComponentLink3Description: https://datasheet.ciiva.com/7941/1686128-7941; ComponentLink4URL: https://datasheet.ciiva.com/16850/rc0805-1685; ComponentLink4Description: https://datasheet.ciiva.com/16850/rc0805-1685; ComponentLink5URL: https://datasheet.ciiva.com/46385/444164-4638; ComponentLink5Description: https://datasheet.ciiva.com/46385/444164-4638; ComponentLink6URL: https://datasheet.ciiva.com/2456/pyu-r-int-th; ComponentLink6Description: https://datasheet.ciiva.com/2456/pyu-r-int-th; Supplier 1: Farnell; Voltage Rating (DC): 150V; Number of Pins: 2
  R?#6: ComponentLink7URL: https://datasheet.ciiva.com/16747/rc0805-1674; ComponentLink7Description: https://datasheet.ciiva.com/16747/rc0805-1674
SW? = 1825910-6: SWITCH TACTILE SPST-NO 0.05A 24V; Manufacturer: TE Connectivity Alcoswitch; Actuator Material: PBT; Mechanical Life: 100000Cycles; Operating Force: 160gf; Throw Configuration: SPST; Illumination Type: Non-Illuminated,Illuminated; Switch Travel: 0.25mm; Switch Function: Off-Mom; Contact Current Rating: 50mA; Actuator Type: Standard; Contact Resistance: 100mR; Actuator Length: 0.055inch; Part Name: 1825910-6; Supplier Part Number 1: 2456210; Manufacturer Part Number: 1825910-6; RoHS: Yes; Category: Pushbutton Switches; Stock 1: 10661; Pricing 1: 1=0,09610, 10=0,08990, 25=0,08680, 100=0,0791; Mount: Through Hole; Contact Material: Copper Alloy; Contact Plating: Silver; Min Operating Temperature: -35°C; Max Operating Temperature: 85°C; Termination: PC Pins; Package Quantity: 750; Packaging: Loose Piece; Orientation: Straight; Max Voltage Rating (DC): 24V; Electrical Life: 100000Cycles; Max Current Rating: 50mA; Type: Switch; Length: 5.99mm; REACH SVHC: Unknown; ELV: Compliant; Lead Free: Lead Free; ComponentLink1URL: https://datasheet.ciiva.com/30199/1825910-6rq; ComponentLink1Description: https://datasheet.ciiva.com/30199/1825910-6rq; ComponentLink2URL: https://datasheet.ciiva.com/15184/getdatashee; ComponentLink2Description: https://datasheet.ciiva.com/15184/getdatashee
U = ATMEGA16U2-AU: MICROCHIP - ATMEGA16U2-AU - MCU, 8BIT, MEGAAV; Manufacturer: Microchip / Atmel; Core Architecture: AVR; Interface: SPI,UART,USB,USART,Serial; Number of I/Os: 22; Frequency: 16MHz; Oscillator Type: Internal; Memory Type: FLASH; Memory Size: 16KB; Peripherals: Brown-out Detect/Reset,POR,PWM,WDT; RAM Size: 512B; Number of Timers/Counters: 2; Min Supply Voltage: 2.7V; Max Supply Voltage: 5.5V; Watchdog Timer: Yes; Data Bus Width: 8b; Number of PWM Channels: 5; Number of SPI Channels: 1; Part Name: ATMEGA16U2-AU; Supplier 1: Farnell; Supplier Part Number 1: 1841607; Manufacturer Part Number: ATMEGA16U2-AU; RoHS: Yes; Category: Microcontrollers; Stock 1: 1255; Pricing 1: 1=1,93000, 25=1,77000, 100=1,61000, 1000=1,59; Mount: Surface Mount; Case/Package: A; Number of Pins: 32; Contact Plating: Tin,Matte; Min Operating Temperature: -40°C; Max Operating Temperature: 85°C; Packaging: Tray; Package Quantity: 1250; Number of Programmable I/O: 22; Max Frequency: 16MHz; Length: 7mm; Width: 7mm; Height: 1.05mm; REACH SVHC: No SVHC; Lead Free: Lead Free; ComponentLink1URL: https://datasheet.ciiva.com/13036/doc7799-287; ComponentLink1Description: https://datasheet.ciiva.com/13036/doc7799-287; ComponentLink2URL: https://datasheet.ciiva.com/22651/doc7799-226; ComponentLink2Description: https://datasheet.ciiva.com/22651/doc7799-226
U?#1 = ATMEGA328P-PU: ATMEGA328P-PU; 8 bit Microcontroller AVR 20MH; Manufacturer: Microchip / Atmel; Interface: I2C,SPI,UART,USART,2-Wire; Number of I/Os: 23; Frequency: 20MHz; Oscillator Type: Internal; Memory Type: FLASH; Memory Size: 32KB; Peripherals: Brown-out Detect/Reset,POR,PWM,WDT; RAM Size: 2KB; Number of Timers/Counters: 3; Min Supply Voltage: 1.8V; Max Supply Voltage: 5.5V; Watchdog Timer: Yes; Data Bus Width: 8b; Number of PWM Channels: 6; Number of SPI Channels: 1; Part Name: ATMEGA328P-PU; Supplier 1: Farnell; Supplier Part Number 1: 1715487; Manufacturer Part Number: ATMEGA328P-PU; RoHS: Yes; Category: Microcontrollers; Stock 1: 11462; Pricing 1: 1=1,73000, 25=1,60000, 100=1,42000, 1000=1,39; Mount: Through Hole; Case/Package: PDIP; Number of Pins: 28; Contact Plating: Tin,Matte; Min Operating Temperature: -40°C; Max Operating Temperature: 85°C; Core Architecture: AVR; Packaging: Rail/Tube; Package Quantity: 14; Number of Programmable I/O: 23; Max Frequency: 20MHz; Number of ADC Channels: 6; Number of I2C Channels: 1; Length: 37.4mm; Width: 6.76mm; Height: 3.28mm; Radiation Hardening: No; REACH SVHC: No SVHC; Lead Free: Lead Free; ComponentLink1URL: https://datasheet.ciiva.com/1157/1684409-1157; ComponentLink1Description: https://datasheet.ciiva.com/1157/1684409-1157; ComponentLink2URL: https://datasheet.ciiva.com/20168/73-4283-201; ComponentLink2Description: https://datasheet.ciiva.com/20168/73-4283-201; ComponentLink3URL: https://datasheet.ciiva.com/19457/2139111-194; ComponentLink3Description: https://datasheet.ciiva.com/19457/2139111-194; ComponentLink4URL: https://datasheet.ciiva.com/26818/atmega328p-; ComponentLink4Description: https://datasheet.ciiva.com/26818/atmega328p-; ComponentLink5URL: https://datasheet.ciiva.com/29119/155197-da-0; ComponentLink5Description: https://datasheet.ciiva.com/29119/155197-da-0; ComponentLink6URL: https://datasheet.ciiva.com/15213/getdatashee; ComponentLink6Description: https://datasheet.ciiva.com/15213/getdatashee
U?#2 U?#3 = SN74AHC1G09DBVR: TEXAS INSTRUMENTS - SN74AHC1G09DBVR - AND Gate, 74AHC1G09, 2 Input, 2 V to 5.5 V, SOT-23-5; Min Supply Voltage: 2V; Max Supply Voltage: 5.5V; Quiescent Current: 1uA; Number of Inputs: 2; Propagation Delay: 7.5ns; Output Current: 25mA; Number of Circuits: 1; Low Level Output Current: 8mA; Part Name: SN74AHC1G09DBVR; Supplier 1: Farnell; Supplier Part Number 1: 3006513; Manufacturer: Texas Instruments; Manufacturer Part Number: SN74AHC1G09DBVR; RoHS: Yes; Category: Logic Gates; Stock 1: 2773; Pricing 1: 5=0,28800, 10=0,18600, 100=0,09420, 250=0,08210, 500=0,07000, 1000=0,04220, 5000=0,03810, 10000=0,03730 (GBP); Mount: Surface Mount; Case/Package: SOT-23; Number of Pins: 5; Contact Plating: Tin,Matte; Min Operating Temperature: -55°C; Max Operating Temperature: 125°C; Logic Function: AND GATE; Package Quantity: 3000; Packaging: Tape and Reel; Number of Gates: 1; Number of Elements: 1; Number of Bits: 1; Series: 74AHC; Technology: CMOS; Output Voltage: 5.5V; Number of Outputs: 1; Radiation Hardening: No; REACH SVHC: No SVHC; Lead Free: Lead Free; RoHS Compliant: Yes; ComponentLink1URL: https://datasheet.ciiva.com/1864/sn74ahc1g09-1864410.pdf?src-supplier=Digi-Key; ComponentLink1Description: https://datasheet.ciiva.com/1864/sn74ahc1g09-1864410.pdf?src-supplier=Digi-Key; ComponentLink2URL: https://datasheet.ciiva.com/1864/sn74ahc1g09-1864411.pdf?src-supplier=Digi-Key; ComponentLink2Description: https://datasheet.ciiva.com/1864/sn74ahc1g09-1864411.pdf?src-supplier=Digi-Key; ComponentLink3URL: https://datasheet.ciiva.com/1864/sn74ahc1g09-1864412.pdf?src-supplier=Digi-Key; ComponentLink3Description: https://datasheet.ciiva.com/1864/sn74ahc1g09-1864412.pdf?src-supplier=Digi-Key
XTAL?#1 XTAL?#2 = ABM7-16.000MHZ-D2Y-T: CRYSTAL 16.0000MHZ 18PF SMD; Manufacturer: Abracon; Frequency Tolerance: 20ppm; Frequency: 16MHz; Frequency Stability: 30ppm; ESR (Equivalent Series Resistance): 50R; Part Name: ABM7-16.000MHZ-D2Y-T; Supplier 1: Farnell; Supplier Part Number 1: 2308713; Manufacturer Part Number: ABM7-16.000MHZ-D2Y-T; RoHS: Yes; Category: Crystals; Stock 1: 2676; Pricing 1: 1=0,70200, 50=0,53400, 100=0,47100, 250=0,459; Mount: Surface Mount; Case/Package: CSMD; Number of Pins: 2; Min Operating Temperature: -40°C; Max Operating Temperature: 85°C; Load Capacitance: 18pF; Packaging: Tape and Reel; Package Quantity: 1000; Tolerance: 20ppm; Termination: SMD/SMT; Resistor Type: Ceramic; Length: 6mm; Width: 3.3mm; Height: 0.055inch; Depth: 3.5mm; Radiation Hardening: No; REACH SVHC: Unknown; Lead Free: Lead Free; ComponentLink1URL: https://datasheet.ciiva.com/15116/getdatashee; ComponentLink1Description: https://datasheet.ciiva.com/15116/getdatashee; ComponentLink2URL: https://datasheet.ciiva.com/22658/947971-2265; ComponentLink2Description: https://datasheet.ciiva.com/22658/947971-2265; ComponentLink3URL: https://datasheet.ciiva.com/5788/abm7-5788054; ComponentLink3Description: https://datasheet.ciiva.com/5788/abm7-5788054; ComponentLink4URL: https://datasheet.ciiva.com/7998/947971-79986; ComponentLink4Description: https://datasheet.ciiva.com/7998/947971-79986; ComponentLink5URL: https://datasheet.ciiva.com/46385/947971-4638; ComponentLink5Description: https://datasheet.ciiva.com/46385/947971-4638; ComponentLink6URL: https://datasheet.ciiva.com/16383/abm7-163831; ComponentLink6Description: https://datasheet.ciiva.com/16383/abm7-163831; ComponentLink7URL: https://datasheet.ciiva.com/18649/abm7-186498; ComponentLink7Description: https://datasheet.ciiva.com/18649/abm7-186498; ComponentLink8URL: https://datasheet.ciiva.com/18649/abm7-186498; ComponentLink8Description: https://datasheet.ciiva.com/18649/abm7-186498; ComponentLink9URL: https://datasheet.ciiva.com/18649/abm7-186498; ComponentLink9Description: https://datasheet.ciiva.com/18649/abm7-186498; ComponentLink10URL: https://datasheet.ciiva.com/26941/getdatashee; ComponentLink10Description: https://datasheet.ciiva.com/26941/getdatashee